# Altium schematic sheet phantom_power_enabler.SchDoc
size A4
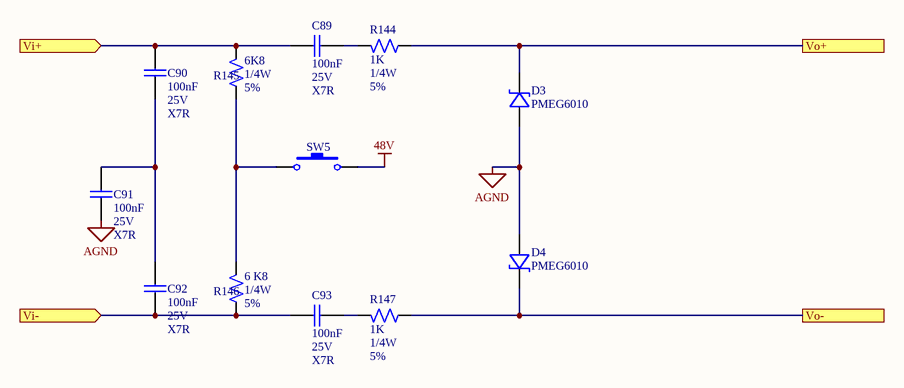
[diagram p0: phantom_power_enabler.SchDoc]

## Parts
C89  valor: 100nF  tension: 25V  tolerancia: X7R  [C0805]  (hidden comment: Capacitor)
C90  valor: 100nF  tension: 25V  tolerancia: X7R  [C0805]  (hidden comment: Capacitor)
C91  valor: 100nF  tension: 25V  tolerancia: X7R  [C0805]  (hidden comment: Capacitor)
C92  valor: 100nF  tension: 25V  tolerancia: X7R  [C0805]  (hidden comment: Capacitor)
C93  valor: 100nF  tension: 25V  tolerancia: X7R  [C0805]  (hidden comment: Capacitor)
D3  PMEG6010  [SOD128]
D4  PMEG6010  [SOD128]
R144  Valor: 1K  Potencia: 1/4W  Tolerancia: 5%  [R0805]  (hidden comment: Resistor)
R145  Valor: 6K8  Potencia: 1/4W  Tolerancia: 5%  [R0805]  (hidden comment: Resistor)
R146  Valor: 6 K8  Potencia: 1/4W  Tolerancia: 5%  [R0805]  (hidden comment: Resistor)
R147  Valor: 1K  Potencia: 1/4W  Tolerancia: 5%  [R0805]  (hidden comment: Resistor)
SW5  TAC_SWITCH_4  [Header 2x1]  (value not drawn)

## Ports
Vi+ (in), Vi- (in), Vo+, Vo-

## Nets
48V: SW5.2
AGND: C91.2 D3.2 D4.2
Vi+: C89.1 C90.1 R145.2 ; port Vi+
Vi-: C92.2 C93.1 R146.1 ; port Vi-
Vo+: D3.1 R144.1 ; port Vo+
Vo-: D4.1 R147.1 ; port Vo-
NetC89_2: C89.2 R144.2
NetC90_2: C90.2 C91.1 C92.1
NetC93_2: C93.2 R147.2
NetR145_1: R145.1 R146.2 SW5.1

## Library data of the parts
C89-C93 = Capacitor: Capacitor de placas paralelas; Encapsulado: 0805
D3 D4 = Schottky Diode: Cod. Proveedor: 1727-5845-1-ND; Encapsulado: SOD-128; Proveedor: Digi-Key; Fabricante: Nexperia; Link: https://www.digikey.com/product-detail/es/PMEG6010EP,115/1727-5845-1-ND/2697507?utm_campaign=buynow&WT.z_cid=ref_octopart_dkc_buynow&utm_medium=aggregator&curr=usd&site=us&utm_source=octopart
R144-R147 = Resistor: Resistencia
SW5 = TAC_SWITCH_4: Pulsador de 4 pines; Proveedor: Digi-Key; Cod. Proveedor: GH1365-ND; Encapsulado: Montaje en panel, posterior; Fabricante: Grayhill Inc.; Link: https://www.digikey.com/product-detail/es/30-3/GH1365-ND/686796?utm_campaign=buynow&WT.z_cid=ref_octopart_dkc_buynow&utm_medium=aggregator&curr=usd&site=us&utm_source=octopart